# EAGLE design emg (EAGLE 6.6.0)
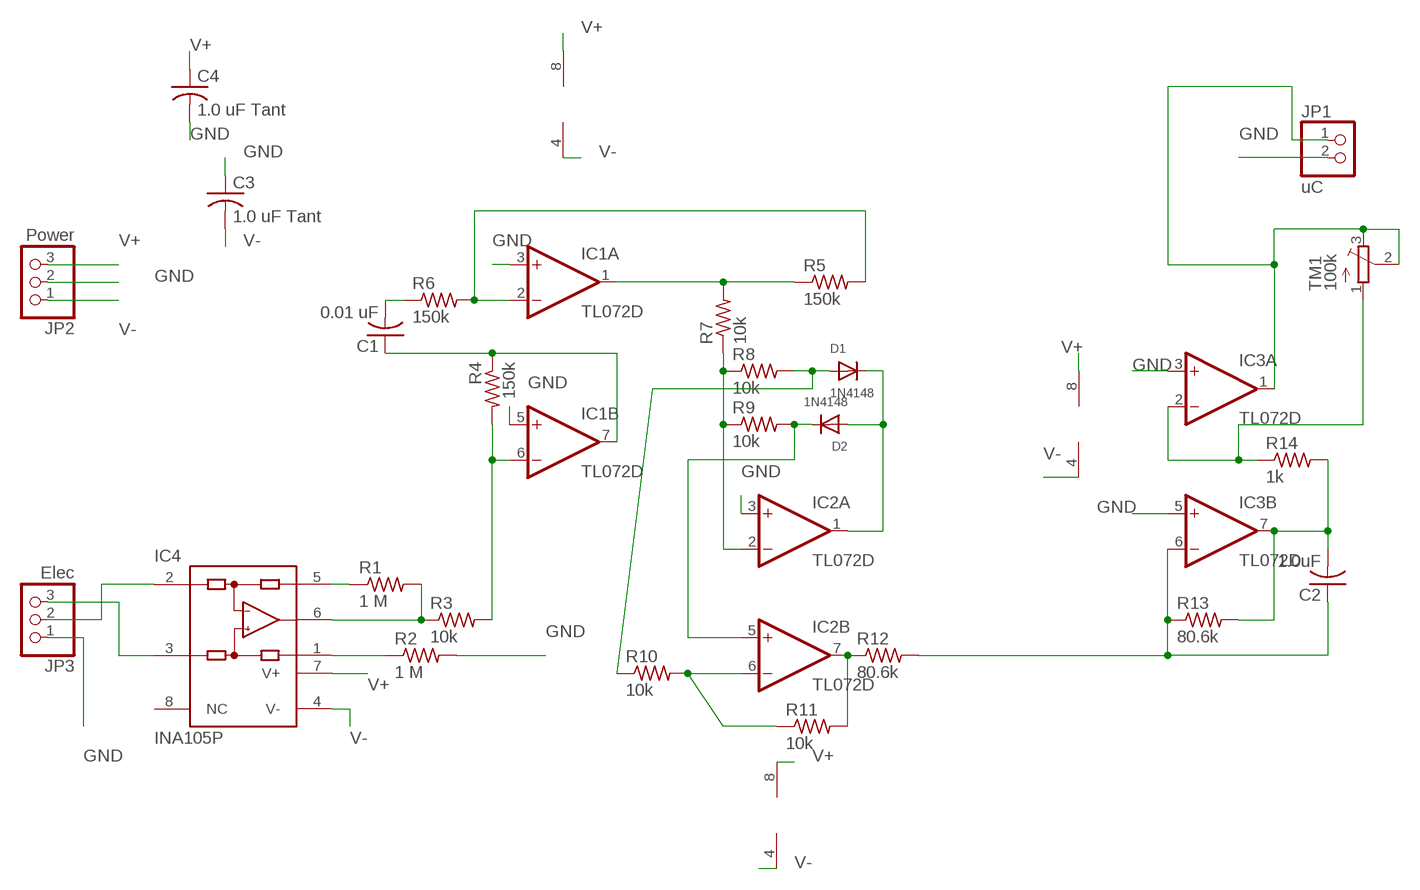
[diagram p0: schematic, sheet 1]

## Parts
C1  0.01 uF  C-USC0603  [C0603]
C2  1.0uF  C-USC0603  [C0603]
C3  1.0 uF Tant  C-USC0805  [C0805]
C4  1.0 uF Tant  C-USC0805  [C0805]
D1  1N4148  DIODEDO-1N4148  [DO-1N4148]
D2  1N4148  DIODEDO-1N4148  [DO-1N4148]
IC1  TL072D  [SO08]
IC2  TL072D  [SO08]
IC3  TL072D  [SO08]
IC4  INA105P  [DIL08]
JP1  uC  PINHD-1X2  [1X02]
JP2  Power  PINHD-1X3  [1X03]
JP3  Elec  PINHD-1X3  [1X03]
R1  1 M  R-US_R0603  [R0603]
R2  1 M  R-US_R0603  [R0603]
R3  10k  R-US_R0603  [R0603]
R4  150k  R-US_R0603  [R0603]
R5  150k  R-US_R0603  [R0603]
R6  150k  R-US_R0603  [R0603]
R7  10k  R-US_R0603  [R0603]
R8  10k  R-US_R0603  [R0603]
R9  10k  R-US_R0603  [R0603]
R10  10k  R-US_R0603  [R0603]
R11  10k  R-US_R0603  [R0603]
R12  80.6k  R-US_R1206  [R1206]
R13  80.6k  R-US_R1206  [R1206]
R14  1k  R-US_R0603  [R0603]
TM1  100k  TRIMPOTTC33X  [TC33X]

## Nets
11: IC1.6(B:-IN) R3.2 R4.2
23: IC1.2(A:-IN) R5.2 R6.2
GND: C3.1 C4.2 IC1.3(A:+IN) IC1.5(B:+IN) IC2.3(A:+IN) IC3.3(A:+IN) IC3.5(B:+IN) JP1.2 JP2.2 JP3.1 R2.2
N$1: IC4.5(SENSE) R1.1
N$2: IC4.1(REF) R2.1
N$3: IC4.6(OUT) R1.2 R3.1
N$4: C1.1 IC1.7(B:OUT) R4.1
N$5: IC3.2(A:-IN) R14.1 TM1.1(A)
N$6: D1.A R8.2 R10.1
N$7: IC1.1(A:OUT) R5.1 R7.2
N$8: D2.C IC2.5(B:+IN) R9.2
N$9: C1.2 R6.1
N$10: D1.C D2.A IC2.1(A:OUT)
N$11: IC2.7(B:OUT) R11.2 R12.1
N$12: C2.2 IC3.7(B:OUT) R13.2 R14.2
N$14: IC4.2(-IN) JP3.2
N$15: IC3.1(A:OUT) JP1.1 TM1.2(S) TM1.3(E)
N$17: IC4.3(+IN) JP3.3
N$18: IC2.6(B:-IN) R10.2 R11.1
O1: C2.1 IC3.6(B:-IN) R12.2 R13.1
P2: IC2.2(A:-IN) R7.1 R8.1 R9.1
V+: C4.1 IC1.8(P:V+) IC2.8(P:V+) IC3.8(P:V+) IC4.7(V+) JP2.3
V-: C3.2 IC1.4(P:V-) IC2.4(P:V-) IC3.4(P:V-) IC4.4(V-) JP2.1
Unconnected: IC4.8(NC)

## Library data of the parts
C1-C4 = adafruit:C-US: CAPACITOR, American symbol
D1 D2 = adafruit:DIODE: Diode SMADIODE - SMA Surface Mount Package 20V 1A Schottky Diode Digikey: 641-1014-6-ND DO-1N4148 - Through Hole Small Current Diode SOD-123 20V 1 A (.5mV Vf) Schottky Diode - Digikey: MBRX120TPMSCT-ND SOD-323 10V 570mA (.38mV Vf, 3ns) Schottky Diode - Digikey: ZLLS410CT-ND SOD-523 30V 30mA Schottky Diode (RB751S-40TE61) - Digikey: RB751S-40TE61CT-ND SOT23-R/W - SOT23 Package (R = Solder Paste/Reflow Ovens, W = Hand-Soldering) BAT54Film 40V 300mA - Digikey: 497-7162-1-ND
IC1-IC3 = linear:TL072: OP AMP
IC4 = burr-brown:INA105: Precision Unity Gain Diff. Amplifier; MF: TEXAS INSTRUMENTS; MPN: INA105KP; OC_FARNELL: 1651850; OC_NEWARK: 04M4538
JP1 = pinhead:PINHD-1X2: PIN HEADER
JP2 JP3 = pinhead:PINHD-1X3: PIN HEADER
R1-R14 = adafruit:R-US_: RESISTOR, American symbol
TM1 = adafruit:TRIMPOT: SMT trimmer potentiometer part number TC33X http://www.ladyada.net/library/eagle

## Board
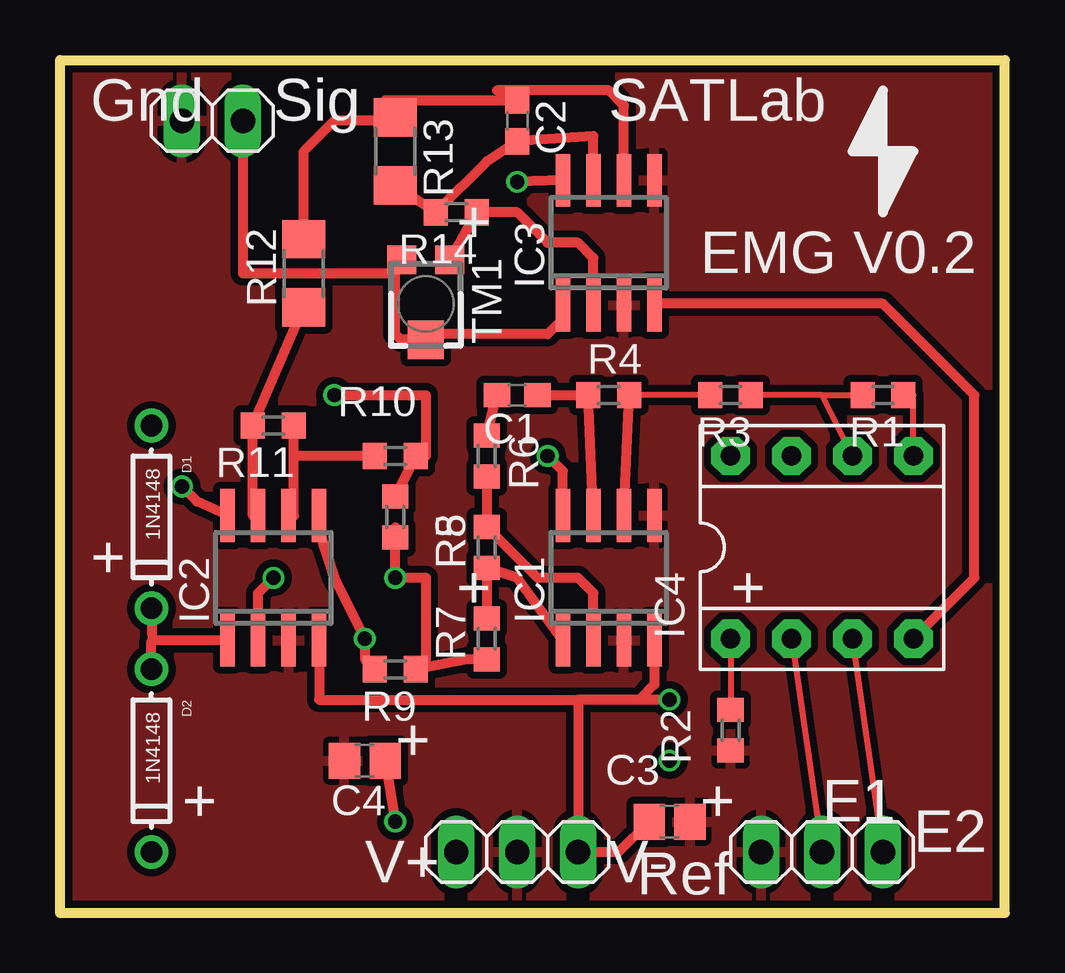
[diagram p1: board, top side]
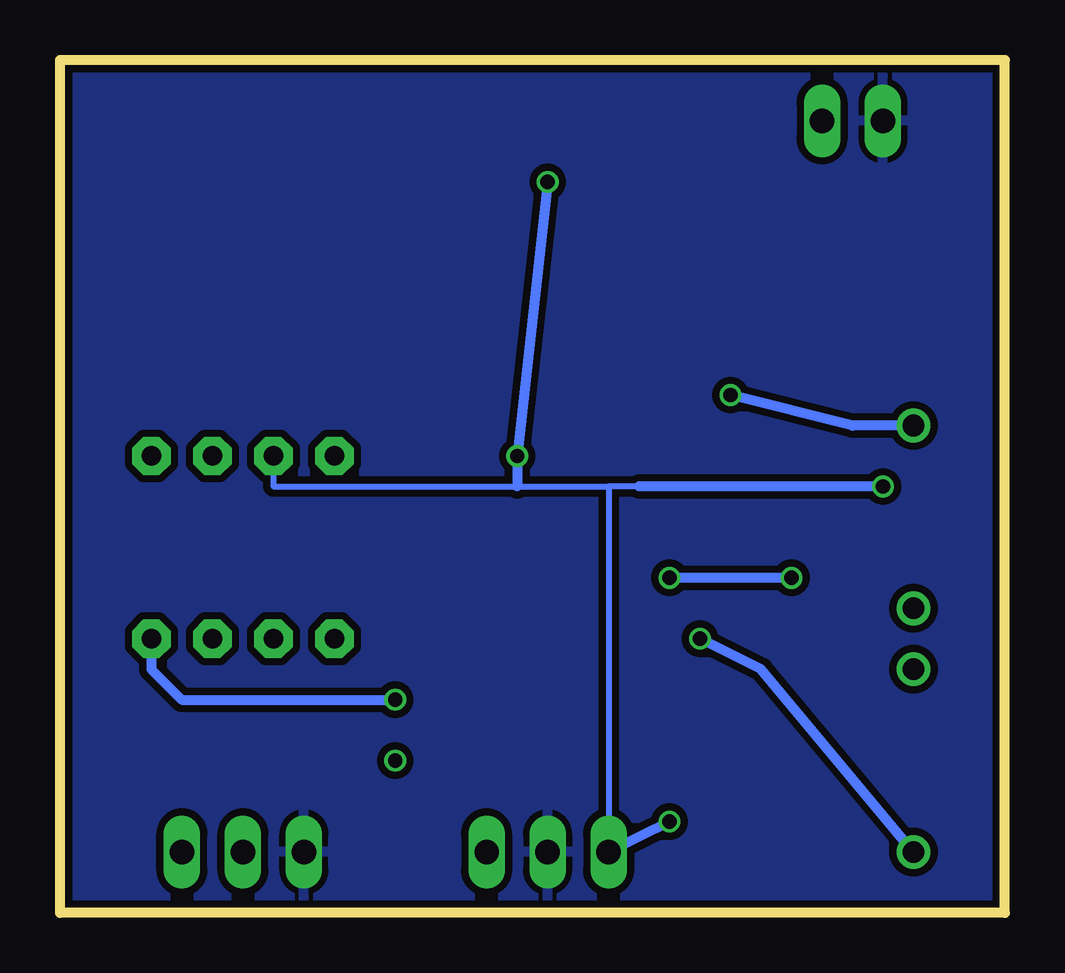
[diagram p2: board, bottom side, seen from below]

Size 39.37 x 35.56 mm. Coordinates in mm from the lower left corner, seen from the top.
Outline: 0,0 0,35.56 39.37,35.56 39.37,0 0,0
Copper layers (1*16): Top 0.035mm / dielectric 1.5mm / Bottom 0.035mm
Design rules "dirt_cheap_dirty_boards.v1": minimum track width 5mil, minimum drill 12mil, track to track 5mil, track to pad 5mil, pad to pad 5mil, via to via 5mil, smd to smd 0mil, copper to edge 10mil, drill to drill 10mil, minimum pad ring 10mil, minimum via ring 6mil, stop-mask expansion 2mil, vias tented up to drill 25mil, thermal gap 10mil

### Footprints (pad centres in the part's own frame; a part is rotated, then mirrored left to right if it is on the bottom)
C0603 = smd 1.1 x 1: 1 -0.85,0; 2 0.85,0
C0805 = smd 1.3 x 1.5: 1 -0.85,0; 2 0.85,0
DO-1N4148 = drill 0.9: A -3.81,0; C 3.81,0
SO08 = smd 0.6 x 2.2: 1 -1.905,-2.6; 2 -0.635,-2.6; 3 0.635,-2.6; 4 1.905,-2.6; 5 1.905,2.6; 6 0.635,2.6; 7 -0.635,2.6; 8 -1.905,2.6
DIL08 = drill 0.813 pad 1.6 octagon: 1 -3.81,-3.81; 2 -1.27,-3.81; 3 1.27,-3.81; 4 3.81,-3.81; 5 3.81,3.81; 6 1.27,3.81; 7 -1.27,3.81; 8 -3.81,3.81
1X02 = drill 1.016 long: 1 -1.27,0; 2 1.27,0
1X03 = drill 1.016 long: 1 -2.54,0; 2 0,0; 3 2.54,0
R0603 = smd 1 x 1.1: 1 -0.85,0; 2 0.85,0
R1206 = smd 1.6 x 1.803: 1 -1.422,0; 2 1.422,0
TC33X = smd 1.2 x 1.2: 1 -1,-1.825; 3 1,-1.825 | smd 1.5 x 1.6: 2 0,1.5

### Placement (x,y rotation side)
C1  19.05,21.59 180 top
C2  19.05,33.02 270 top
C3  25.4,3.81 180 top
C4  12.7,6.35 180 top
D1  3.81,16.51 270 top
D2  3.81,6.35 270 top
IC1  22.86,13.97 0 top
IC2  8.89,13.97 0 top
IC3  22.86,27.94 0 top
IC4  31.75,15.24 0 top
JP1  6.35,33.02 180 top
JP2  19.05,2.54 180 top
JP3  31.75,2.54 0 top
R1  34.29,21.59 180 top
R2  27.94,7.62 270 top
R3  27.94,21.59 180 top
R4  22.86,21.59 0 top
R5  17.78,15.24 90 top
R6  17.78,19.05 270 top
R7  17.78,11.43 90 top
R8  13.97,16.51 90 top
R9  13.97,10.16 180 top
R10  13.97,19.05 180 top
R11  8.89,20.32 180 top
R12  10.16,26.67 90 top
R13  13.97,31.75 270 top
R14  16.51,29.21 180 top
TM1  15.24,25.4 180 top

### Tracks (layer width: path | path; a pad name or v marks a point on that pad's centre or on a via)
11
  Top 0.254: R3.2 R4.2
  Top 0.406: IC1.6 R4.2
23
  Top 0.406: R6.2 R5.2 19.9,13.97 21.59,13.97 22.22,13.34 IC1.2
GND
  pour Top (isolate 0.305): 0,0 0,35.56 39.37,35.56 39.37,0
  pour Bottom (isolate 0.305): 0,0 0,35.56 39.37,35.56 39.37,0
N$1
  Top 0.254: IC4.5 35.56,21.59 R1.1
N$2
  Top 0.254: IC4.1 R2.1
N$3
  Top 0.254: 31.75,21.59 R3.1 | IC4.6 31.75,21.59 | 31.75,21.59 R1.2
N$4
  Top 0.406: IC1.7 R4.1 C1.1
N$5
  Top 0.406: IC3.2 22.22,27.3 21.59,27.94 20.32,27.94 19.05,29.21 R14.1 TM1.1
N$6  (via drill 0.6)
  Top 0.406: R8.2 R10.1 15.24,19.05 15.24,21.59 v11.43,21.59
  Bottom 0.406: D1.A 6.35,20.32 v11.43,21.59
N$7
  Top 0.406: R7.2 R5.1 19.05,13.97 IC1.1
N$8  (via drill 0.6)
  Top 0.406: IC2.5 10.79,15.88 11.43,13.97 v12.7,11.43 12.7,10.58 R9.2
  Bottom 0.406: D2.C 10.16,10.16 v12.7,11.43
N$9
  Top 0.406: R6.1 C1.2
N$10
  Top 0.406: IC2.1 3.87,11.37 | 3.87,11.37 D1.C | D2.A 3.81,11.31 3.87,11.37
N$11
  Top 0.406: R12.1 R11.2 8.04,16.57 IC2.7
N$12
  Top 0.406: IC3.7 22.22,32.38 C2.2 17.78,31.33 R14.2 R13.2
N$14
  Top 0.254: IC4.2 JP3.2
N$15
  Top 0.127: 13.97,26.67 TM1.3
  Top 0.406: IC3.1 20.95,24.77 20.32,24.13 15.47,24.13 TM1.2 14.2,23.9 13.97,24.13 13.97,26.67 | 13.97,26.67 13.97,26.95 TM1.3 | JP1.1 7.62,26.67 13.97,26.67
N$16  (via drill 0.6)
  other vias: 25.4,6.35
N$17
  Top 0.254: IC4.3 JP3.3
N$18
  Top 0.406: IC2.6 9.74,16.57 9.74,19.05 | 9.74,19.05 R11.1 | R10.2 9.74,19.05
O1
  Top 0.406: IC3.6 23.5,33.66 22.86,34.29 18.2,34.29 C2.1 13.55,33.87 R13.1 13.82,33.02 11.43,33.02 10.16,31.75 R12.2
P2  (via drill 0.6)
  Top 0.406: R7.1 16.94,10.58 R9.1 15.24,10.58 15.24,13.97 v13.97,13.97 R8.1 13.97,16.09 | IC2.2 8.25,13.34 v8.89,13.97
  Bottom 0.406: v8.89,13.97 v13.97,13.97
V+  (via drill 0.6)
  Top 0.406: C4.1 v13.97,3.81 | IC2.8 5.71,17.14 v5.08,17.78 | 20.95,15.88 IC1.8 20.95,18.41 v20.32,19.05 | IC3.8 v19.05,30.48
  Bottom 0.254: 16.51,17.78 JP2.3 | 16.51,17.78 20.32,17.78 30.48,17.78 IC4.7 | 15.24,17.78 16.51,17.78
  Bottom 0.406: v13.97,3.81 JP2.3 | v5.08,17.78 15.24,17.78 | 20.32,17.78 v20.32,19.05 v19.05,30.48
V-  (via drill 0.6)
  Top 0.406: 21.59,8.89 JP2.1 23.28,2.54 C3.2 | IC1.4 24.76,9.53 24.13,8.89 | 24.13,8.89 21.59,8.89 | v25.4,8.89 24.13,8.89 | IC2.4 10.79,8.89 21.59,8.89 | IC4.4 38.1,13.97 38.1,21.59 34.29,25.4 24.82,25.4 IC3.4
  Bottom 0.406: IC4.4 35.56,10.16 34.29,8.89 v25.4,8.89

### Text on the board
tPlace: Gnd | Sig | SATLab | + | EMG V0.2 | + | + | + | + | + | + | E1 | Ref | E2 | V+ | V-